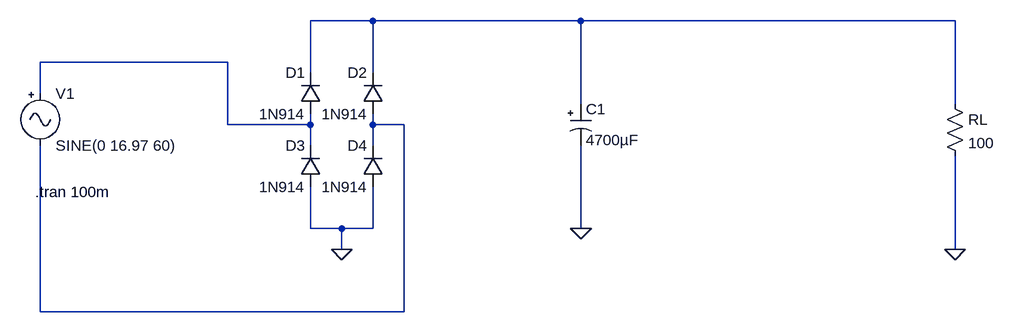
[diagram p0: schematic aula2_2.asc]
aula2_2.asc, the LTspice schematic file:
Version 4
SHEET 1 880 756
WIRE -320 272 -416 272
WIRE 0 272 -320 272
WIRE 576 272 0 272
WIRE -544 336 -832 336
WIRE -416 352 -416 272
WIRE -320 352 -320 272
WIRE -832 384 -832 336
WIRE 0 400 0 272
WIRE 576 400 576 272
WIRE -544 432 -544 336
WIRE -416 432 -416 416
WIRE -416 432 -544 432
WIRE -320 432 -320 416
WIRE -272 432 -320 432
WIRE -416 464 -416 432
WIRE -320 464 -320 432
WIRE -416 592 -416 528
WIRE -368 592 -416 592
WIRE -320 592 -320 528
WIRE -320 592 -368 592
WIRE 0 592 0 464
WIRE -368 624 -368 592
WIRE 576 624 576 480
WIRE -832 720 -832 464
WIRE -272 720 -272 432
WIRE -272 720 -832 720
FLAG -368 624 0
FLAG 576 624 0
FLAG 0 592 0
SYMBOL diode -400 416 R180
WINDOW 0 24 64 Left 2
WINDOW 3 24 0 Left 2
SYMATTR InstName D1
SYMATTR Value 1N914
SYMBOL diode -304 416 R180
WINDOW 0 24 64 Left 2
WINDOW 3 24 0 Left 2
SYMATTR InstName D2
SYMATTR Value 1N914
SYMBOL diode -400 528 R180
WINDOW 0 24 64 Left 2
WINDOW 3 24 0 Left 2
SYMATTR InstName D3
SYMATTR Value 1N914
SYMBOL diode -304 528 R180
WINDOW 0 24 64 Left 2
WINDOW 3 24 0 Left 2
SYMATTR InstName D4
SYMATTR Value 1N914
SYMBOL res 560 384 R0
SYMATTR InstName RL
SYMATTR Value 100
SYMBOL Misc\\signal -832 368 R0
WINDOW 123 0 0 Left 0
WINDOW 39 0 0 Left 0
SYMATTR InstName V1
SYMATTR Value SINE(0 16.97 60)
SYMBOL polcap -16 400 R0
SYMATTR InstName C1
SYMATTR Value 4700µF
TEXT -840 536 Left 2 !.tran 100m

The netlist it stands for:
* aula2_2.asc
D1 N002 N001 1N914
D2 N003 N001 1N914
D3 0 N002 1N914
D4 0 N003 1N914
RL N001 0 100
V1 N002 N003 SINE(0 16.97 60)
C1 N001 0 4700µF
.model D D
.lib standard.dio
.tran 100m
.backanno
.end